# EAGLE schematic pilot (EAGLE 9.3.2)
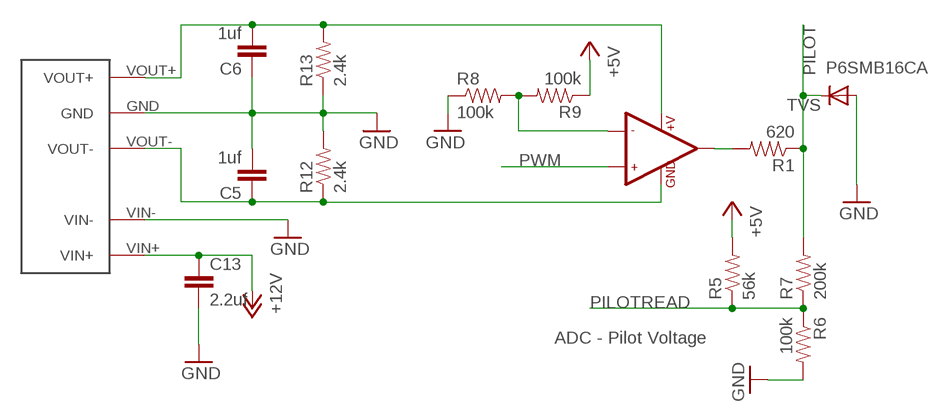
[diagram p0: schematic, sheet 1]

## Parts
C5  1uf  CAP0805  [0805]
C6  1uf  CAP0805  [0805]
C13  2.2uf  CAP0805  [0805]
DCDC  MD112D-12E  DCDC_SIP  [DCDC_SIP]
IC4  LF353  LMV358  [SO08]
R1  620  RESISTOR0805-RES  [0805]
R5  56k  RESISTOR0805-RES  [0805]
R6  100k  RESISTOR0805-RES  [0805]
R7  200k  RESISTOR0805-RES  [0805]
R8  100k  RESISTOR0805-RES  [0805]
R9  100k  RESISTOR0805-RES  [0805]
R12  2.4k  RESISTOR0805-RES  [0805]
R13  2.4k  RESISTOR0805-RES  [0805]
TVS  P6SMB16CA  DIODE-SMB  [SMB]

## Nets
12V: C6.2 DCDC.VOUT+ IC4.8(+V) R13.2
+5V: R5.2 R9.1
+12V: C13.1 DCDC.VIN+
-12V: C5.1 DCDC.VOUT- IC4.4(GND) R12.1
GND: C5.2 C6.1 C13.2 DCDC.GND DCDC.VIN- R6.2 R8.1 R12.2 R13.1 TVS.A
N$10: IC4.2(-IN1) R8.2 R9.2
N$11: IC4.1(OUT1) R1.2
PILOT: R1.1 R7.2 TVS.C
PILOTREAD: R5.1 R6.1 R7.1
PWM: IC4.3(+IN1)
Unconnected: IC4.5(+IN2) IC4.6(-IN2) IC4.7(OUT2)

## Notes on the sheet
- ADC - Pilot Voltage

## Library data of the parts
C5 C6 C13 = SparkFun:CAP: Capacitor Standard 0603 ceramic capacitor, and 0.1" leaded capacitor.
DCDC = Qxd:DCDC_SIP
IC4 = SparkFun:LMV358
R1 R5-R9 R12 R13 = SparkFun:RESISTOR: Resistor Basic schematic elements and footprints for 0603, 1206, and PTH resistors.
TVS = diode:DIODE-: DIODE